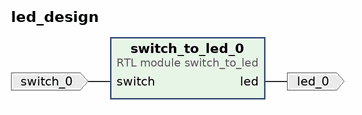
[diagram p0: block diagram of the top level]
# Vivado block design led_design, xc7z020clg400-1, Vivado 2024.2
create_bd_design led_design

create_bd_port -dir I switch_0
create_bd_port -dir O led_0

create_bd_cell -type module -reference switch_to_led switch_to_led_0

# ---- connections ----

connect_bd_net -net switch_0_1 [get_bd_ports switch_0] [get_bd_pins switch_to_led_0/switch]
connect_bd_net [get_bd_pins switch_to_led_0/led] [get_bd_ports led_0]

validate_bd_design
save_bd_design
